# Altium schematic sheet Joystick_OMNI_Schematic.SchDoc: Joystick OMNI PCB
size A4; Revision: 1.0
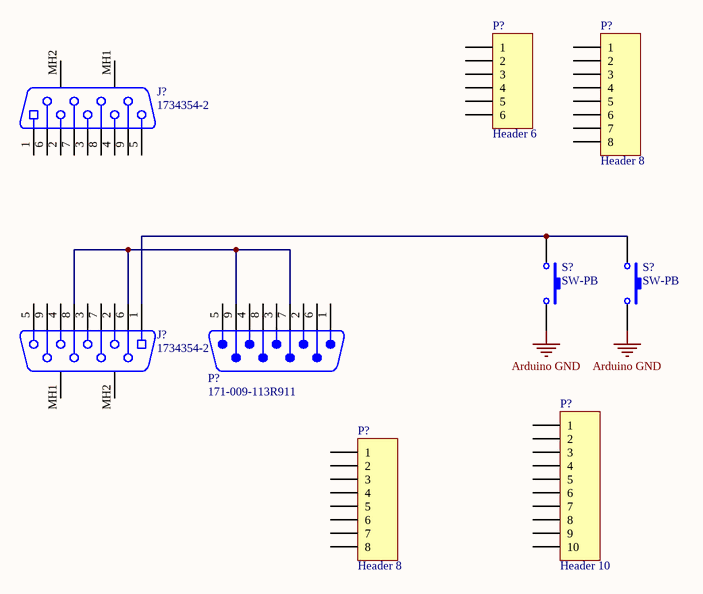
[diagram p0: Joystick_OMNI_Schematic.SchDoc]

## Parts
(Parts that share a designator on the sheet are numbered #1, #2 ... from top to bottom, then left to right.)
J?#1  1734354-2  [TECO-1734354-2_V]
J?#2  1734354-2  [TECO-1734354-2_V]
P?#1  Header 6  [HDR1X6]
P?#2  Header 8  [HDR1X8]
P?#3  171-009-113R911  [NORCO-171-009-113R911_V]
P?#4  Header 10  [HDR1X10]
P?#5  Header 8  [HDR1X8]
S?#1  SW-PB  [SPST-2]
S?#2  SW-PB  [SPST-2]

## Nets
Arduino GND: S?#1.2 S?#2.2
NetJ?#2_1: J?#2.1 S?#1.1 S?#2.1
NetJ?#2_6: J?#2.6 J?#2.8 P?#3.7 P?#3.9

Not connected (* = marked no-connect by the designer): J?#1 1 2 3 4 5 6 7 8 9 MH1 MH2; J?#2 2 3 4 5 7 9 MH1 MH2; P?#1 1 2 3 4 5 6; P?#2 1 2 3 4 5 6 7 8; P?#3 1 2 3 4 5 6 8; P?#4 1 2 3 4 5 6 7 8 9 10; P?#5 1 2 3 4 5 6 7 8

## Library data of the parts
J?#1 J?#2 = CMP-2000-05500-1: Female D-Sub Connector, Pitch 2.77 mm, 9 Position, Height 12.75 mm, Tail Length 3.2 mm, -55 to 105 degC, RoHS, Tray; Manufacturer: TE Connectivity; Product Training Modules: AMPLIMITED-SubConnectors; Flange Feature: MatingSide;FemaleScrewlock(4-40); Connector Type: Receptacle,FemaleSockets; 3D Model: 1734354-2.pdf; Dynamic Catalog: AMPLIMITEHD-20Series; Featured Product: AMPLIMITED-SubminiatureConnectors; Number of Positions: 9; Other Names: A35108; Current Rating: 2A; Voltage Rating: 250V; Mating Products: AML09B-ND / -CONND-SUBPLUG9POSGOLD; Catalog Drawings: AMPD-SubMale.318; Housing Material: Polyamide(PA9T),Nylon9T,GlassFilled; Connector Style: D-Sub; Datasheet Version: Rev. A1, 03/2011; Category: Connectors,Interconnects; Shell Material, Finish: Steel,NickelPlated; Standard Package: 90; Color: Black; Contact Finish: Gold; Contact Type: Signal; Contact Finish Thickness: 15µin(0.38µm); Datasheet URL: http://www.te.com/commerce/DocumentDelivery/DDEController?Action=showdoc&DocId=Customer+Drawing%7F1734354%7FA1%7Fpdf%7FEnglish%7FENG_CD_1734354_A1.pdf%7F1734354-2; Mounting Type: ThroughHole,RightAngle; Features: BoardLock; RoHS Information: 1734354-2StatementofCompliance; Series: AMPLIMITEHD-20; Number of Rows: 2; Termination: Solder; Package Description: Female D-Sub Connector, Pitch 2.77 mm, 9 Position, Height 12.75 mm, Tail Length 3.2 mm; Mounting Technology: ThroughHole; Shell Size, Connector Layout: 1(DE,E); Family: D-SubConnectors; Manufacturer URL: http://www.te.com/; Operating Temperature: -55°C~105°C; Package Reference: 1734354-2
P?#1 = Header 6: Header, 6-Pin; LatestRevisionDate: 17-Jul-2002; LatestRevisionNote: Re-released for DXP Platform.; Publisher: Altium Limited
P?#2 P?#5 = Header 8: Header, 8-Pin; LatestRevisionDate: 17-Jul-2002; LatestRevisionNote: Re-released for DXP Platform.; Publisher: Altium Limited
P?#3 = CMP-2000-05495-1: Male Header, Pitch 2.77 mm, 2 Row, 9 Position, Height 12.52 mm, Tail Length 4.8 mm, -55 to 100 degC, RoHS, Tray; Manufacturer: Norcomp; Other Names: 171009113R9119209ME; Mating Products: 4209FE-ND-CONND-SUBRCPT9POSVERTSOLDER709FE-ND-CONNDB9CRIMPFEMALENICKEL709FER-ND-CONNDB9CRIMPFEMALETIN186-009-292L001-ND-CONNDSUBRCPT9POSSTRIDC186-009-292L551-ND-CONNDSUBRCPT9POSSTRIDC209F-ND-CONNDSUBRCPT9POSSTRSLDRCUP709F-ND-CONNDB9CRIMPFEMALETIN1709F-ND-CONNDB9CRIMPFEMYLWCHROME4209F-ND-CONND-SUBRCPT9POSVERTSOLDER1709FA-ND-CONNDB9CRIMPFEMYLWCHROME209FEA-ND-CONNDSUBRCPT9POSSTRSLDRCUP; Number of Positions: 9; Catalog Drawings: Footprint9,15,25-,37Position171,172SeriesDipSolder; Other Related Documents: 171-009-113R911MaterialDeclaration; Online Catalog: 171Series; Flange Feature: MatingSide,FemaleScrewlock(4-40); Product Training Modules: D-SubConnectors; Connector Style: D-Sub; Current Rating: 5A; Connector Type: Plug,MalePins; Associated Product: 160-09MA-ND-DUSTCOVERFORDB9MALE; 3D Model: 171-009-113Rzzz.pdf171-009-113Rzzz.stp171-009-113Rzzz.igs; Voltage Rating: -; Packaging: Tray; Operating Temperature: -50°C~100°C; Number of Rows: 2; Datasheet URL: http://www.norcomp.net/rohspdfs/Connectors/17Y/171/171-YYY-113RYY1.pdf; Housing Material: Polyamide(PA9T),Nylon9T; Color: Black; Series: 171; Mounting Technology: ThroughHole; Ingress Protection: -; Features: BoardLock,GroundingIndents; Family: D-SubConnectors; Category: Connectors,Interconnects; Termination: Solder; Shell Material, Finish: Steel,NickelPlated; Standard Package: 80; Package Description: Male Header, Pitch 2.77 mm, 2 Row, 9 Position, Height 12.52 mm, Tail Length 4.8 mm; Manufacturer URL: http://www.norcomp.net/; Mounting Type: ThroughHole; Datasheet Version: Rev. 11, 09/2015; Package Reference: 171-009-113R911; Contact Finish: Gold; Shell Size, Connector Layout: 1(DE,E); Contact Type: Signal; Contact Finish Thickness: Flash
P?#4 = Header 10: Header, 10-Pin; LatestRevisionDate: 17-Jul-2002; LatestRevisionNote: Re-released for DXP Platform.; Publisher: Altium Limited
S?#1 S?#2 = SW-PB: Switch; Published: 24-Mar-1999; LatestRevisionDate: 17-Jul-2002; LatestRevisionNote: Re-released for DXP Platform.; PackageReference: SPST-2; Publisher: Altium Limited; PackageDescription: Switch; 2 Leads